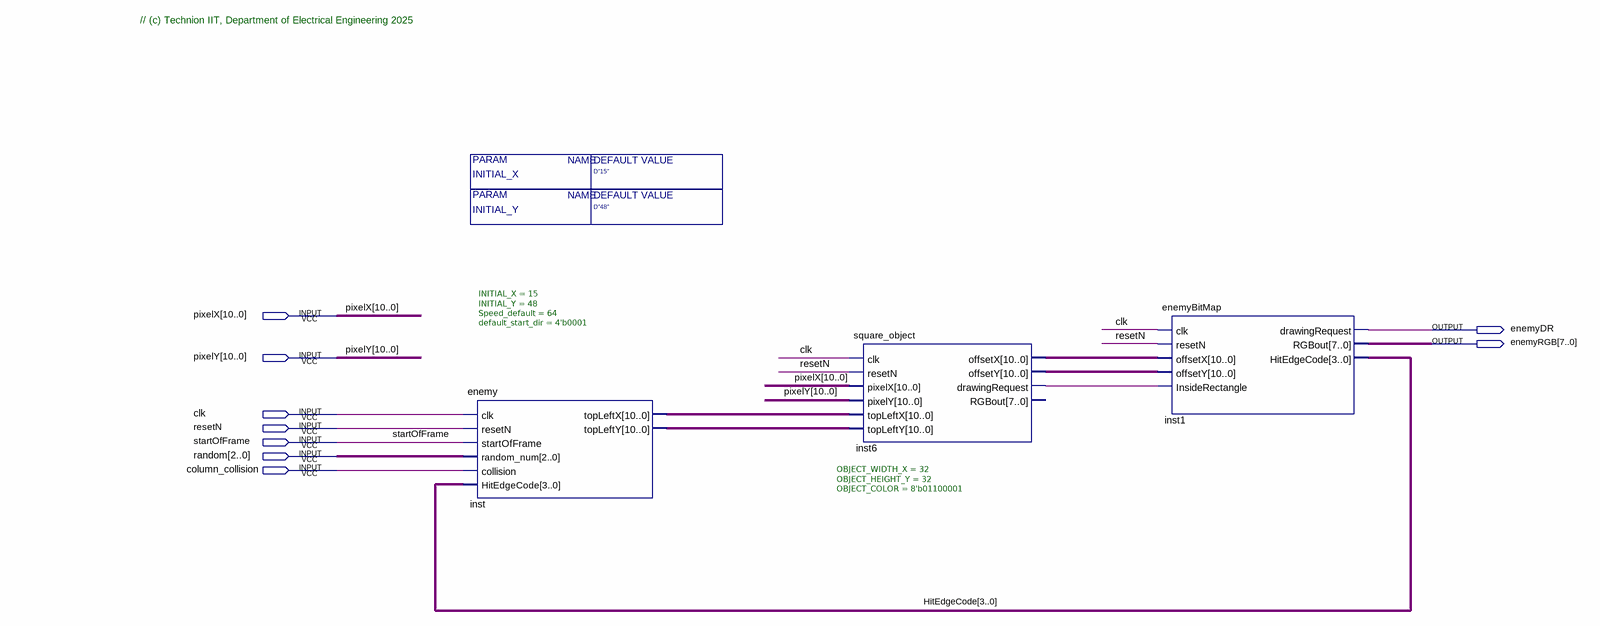
[diagram p0: schematic sheet]
// Quartus schematic Enemy_Block_T.bdf as structural Verilog: 3 symbols, 9 pins
module Enemy_Block_T #(parameter INITIAL_X = "D\"15\"", parameter INITIAL_Y = "D\"48\"") (
  input  [10:0] pixelX,
  input  [10:0] pixelY,
  input  clk,
  input  resetN,
  input  startOfFrame,
  input  [2:0] random,
  input  column_collision,
  output enemyDR,
  output [7:0] enemyRGB
);

  wire inst6_drawingrequest;
  wire [3:0] HitEdgeCode;
  wire [10:0] inst6_offsetx, inst6_offsety, inst_topleftx, inst_toplefty;

  enemy #(.INITIAL_X(15), .INITIAL_Y(48), .Speed_default(64), .default_start_dir(4'b0001)) inst (
    .clk(clk), .resetN(resetN), .startOfFrame(startOfFrame), .random_num(random),
    .collision(column_collision), .HitEdgeCode(HitEdgeCode), .topLeftX(inst_topleftx),
    .topLeftY(inst_toplefty));
  square_object #(.OBJECT_WIDTH_X(32), .OBJECT_HEIGHT_Y(32), .OBJECT_COLOR(8'b01100001)) inst6 (
    .clk(clk), .resetN(resetN), .pixelX(pixelX), .pixelY(pixelY), .topLeftX(inst_topleftx),
    .topLeftY(inst_toplefty), .offsetX(inst6_offsetx), .offsetY(inst6_offsety),
    .drawingRequest(inst6_drawingrequest));  // open: RGBout
  enemyBitMap inst1 (
    .clk(clk), .resetN(resetN), .offsetX(inst6_offsetx), .offsetY(inst6_offsety),
    .InsideRectangle(inst6_drawingrequest), .drawingRequest(enemyDR), .RGBout(enemyRGB),
    .HitEdgeCode(HitEdgeCode));

  // Notes on the sheet:
  //   // (c) Technion IIT, Department of Electrical Engineering 2025
endmodule
